# EAGLE design Group Project PCB first draft (EAGLE 9.6.2)
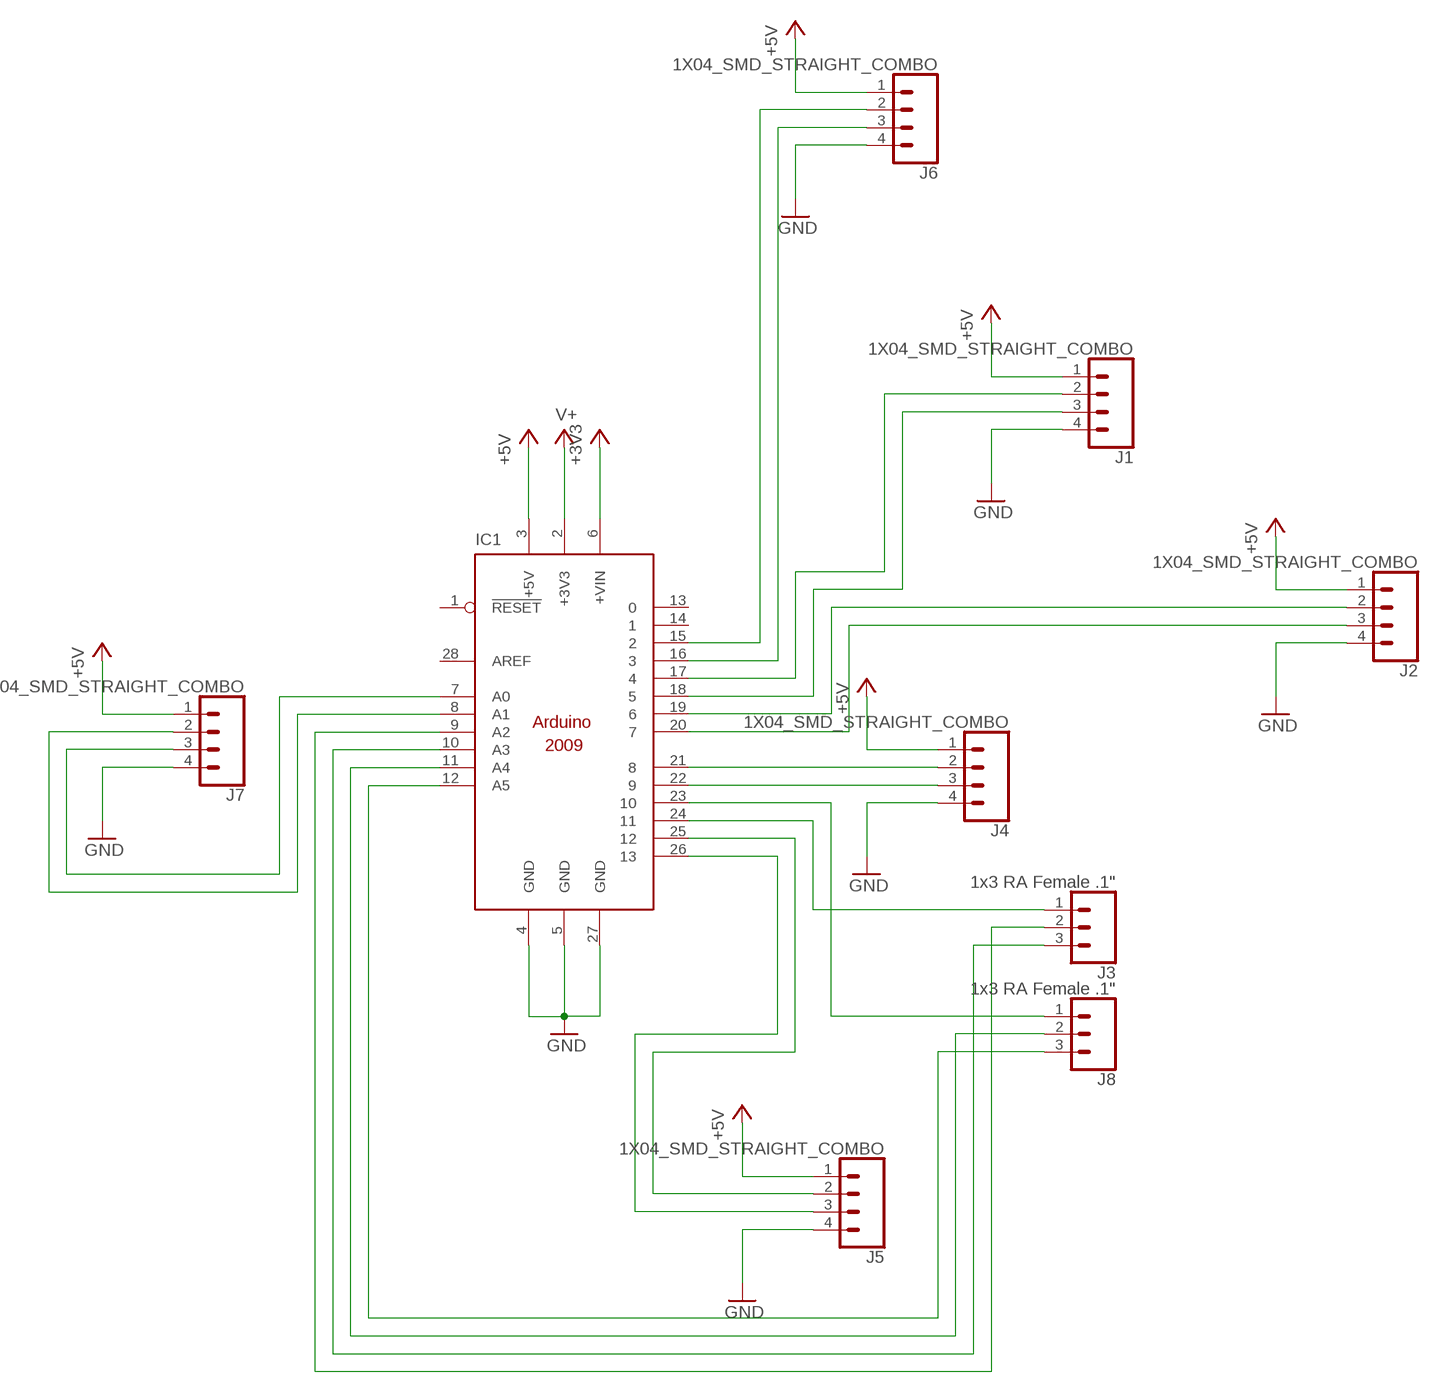
[diagram p0: schematic, sheet 1]

## Parts
IC1  ARDUINO2009_10  [ARDUINO2009]
J1  1X04_SMD_STRAIGHT_COMBO  CONN_04LONGPADS  [1X04_LONGPADS]
J2  1X04_SMD_STRAIGHT_COMBO  CONN_04LONGPADS  [1X04_LONGPADS]
J3  1x3 RA Female .1"  CONN_03LONGPADS  [1X03_LONGPADS]
J4  1X04_SMD_STRAIGHT_COMBO  CONN_04LONGPADS  [1X04_LONGPADS]
J5  1X04_SMD_STRAIGHT_COMBO  CONN_04LONGPADS  [1X04_LONGPADS]
J6  1X04_SMD_STRAIGHT_COMBO  CONN_04LONGPADS  [1X04_LONGPADS]
J7  1X04_SMD_STRAIGHT_COMBO  CONN_04LONGPADS  [1X04_LONGPADS]
J8  1x3 RA Female .1"  CONN_03LONGPADS  [1X03_LONGPADS]

## Nets
+3V3: IC1.6(+VIN)
+5V: IC1.3(+5V) J1.1 J2.1 J4.1 J5.1 J6.1 J7.1
GND: IC1.4(GND) IC1.5(GND) IC1.27(GND) J1.4 J2.4 J4.4 J5.4 J6.4 J7.4
N$1: IC1.17 J1.2
N$2: IC1.18 J1.3
N$3: IC1.21 J4.2
N$4: IC1.22 J4.3
N$5: IC1.19 J2.2
N$6: IC1.20 J2.3
N$7: IC1.8(A1) J7.2
N$8: IC1.7(A0) J7.3
N$9: IC1.25 J5.2
N$10: IC1.26 J5.3
N$11: IC1.15 J6.2
N$12: IC1.16 J6.3
N$13: IC1.23 J8.1
N$14: IC1.24 J3.1
N$15: IC1.9(A2) J3.2
N$16: IC1.11(A4) J8.2
N$17: IC1.10(A3) J3.3
N$18: IC1.12(A5) J8.3
V+: IC1.2(+3V3)
Unconnected: IC1.1(!RESET) IC1.13 IC1.14 IC1.28(AREF)

## Library data of the parts
IC1 = arduino:ARDUINO2009_1: The Arduino Duemilanove ("2009") is a microcontroller board based on the ATmega168 or ATmega328. - 14 digital input/output pins (of which 6 can be used as PWM outputs) - 6 analog inputs, a 16 MHz crystal oscillator - USB connection - power jack - ISP header - reset button It contains everything needed to support the microcontroller; simply connect it to a computer with a USB cable or power it with a AC-to-DC adapter or battery to get started http://arduino.cc/en/Main/ArduinoBoardDuemilanove
J1 J2 J4-J7 = EENG3110 V1 Library:CONN_04: Multi connection point. Often used as Generic Header-pin footprint for 0.1 inch spaced/style header connections On any of the 0.1 inch spaced packages, you can populate with these: Break Away Headers - Straight <https://www.sparkfun.com/products/116> (PRT-00116) Break Away Male Headers - Right Angle <https://www.sparkfun.com/products/553> (PRT-00553) Female Headers <https://www.sparkfun.com/products/115> (PRT-00115) Break Away Headers - Machine Pin <https://www.sparkfun.com/products/117> (PRT-00117) Break Away Female Headers - Swiss Machine Pin <https://www.sparkfun.com/products/743> (PRT-00743) For SCREWTERMINALS and SPRING TERMINALS visit here: Screw Terimnals on SparkFun.com <https://www.sparkfun.com/search/results?term=Screw+Terminals> (5mm/3.5mm/2.54mm spacing) This device is also useful as a general connection point to wire up your design to another part of your project. Our various solder wires solder well into these plated through hole pads. Hook-Up Wire - Assortment (Stranded, 22 AWG) <https://www.sparkfun.com/products/11375> (PRT-11375) Hook-Up Wire - Assortment (Solid Core, 22 AWG) <https://www.sparkfun.com/products/11367> (PRT-11367) View the entire wire category on our website here <https://www.sparkfun.com/categories/141> Special notes: Molex polarized connector foot print use with SKU : PRT-08231 with associated crimp pins and housings. 1MM SMD Version SKU: PRT-10208; PROD_ID: CONN-08511; SF_ID: PRT-12638
J3 J8 = EENG3110 V1 Library:CONN_03: Multi connection point. Often used as Generic Header-pin footprint for 0.1 inch spaced/style header connections On any of the 0.1 inch spaced packages, you can populate with these: Break Away Headers - Straight <https://www.sparkfun.com/products/116> (PRT-00116) Break Away Male Headers - Right Angle <https://www.sparkfun.com/products/553> (PRT-00553) Female Headers <https://www.sparkfun.com/products/115> (PRT-00115) Break Away Headers - Machine Pin <https://www.sparkfun.com/products/117> (PRT-00117) Break Away Female Headers - Swiss Machine Pin <https://www.sparkfun.com/products/743> (PRT-00743) Stackable Header - 3 Pin (Female, 0.1") <https://www.sparkfun.com/products/13875> (PRT-13875) For SCREWTERMINALS and SPRING TERMINALS visit here: Screw Terimnals on SparkFun.com <https://www.sparkfun.com/search/results?term=Screw+Terminals> (5mm/3.5mm/2.54mm spacing) This device is also useful as a general connection point to wire up your design to another part of your project. Our various solder wires solder well into these plated through hole pads. Hook-Up Wire - Assortment (Stranded, 22 AWG) <https://www.sparkfun.com/products/11375> (PRT-11375) Hook-Up Wire - Assortment (Solid Core, 22 AWG) <https://www.sparkfun.com/products/11367> (PRT-11367) View the entire wire category on our website here <https://www.sparkfun.com/categories/141> Special notes: Molex polarized connector foot print use with SKU : PRT-08232 with associated crimp pins and housings.; PROD_ID: CONN-10925; SF_ID: PRT-08235; SF_SKU: PRT-08433

## Board
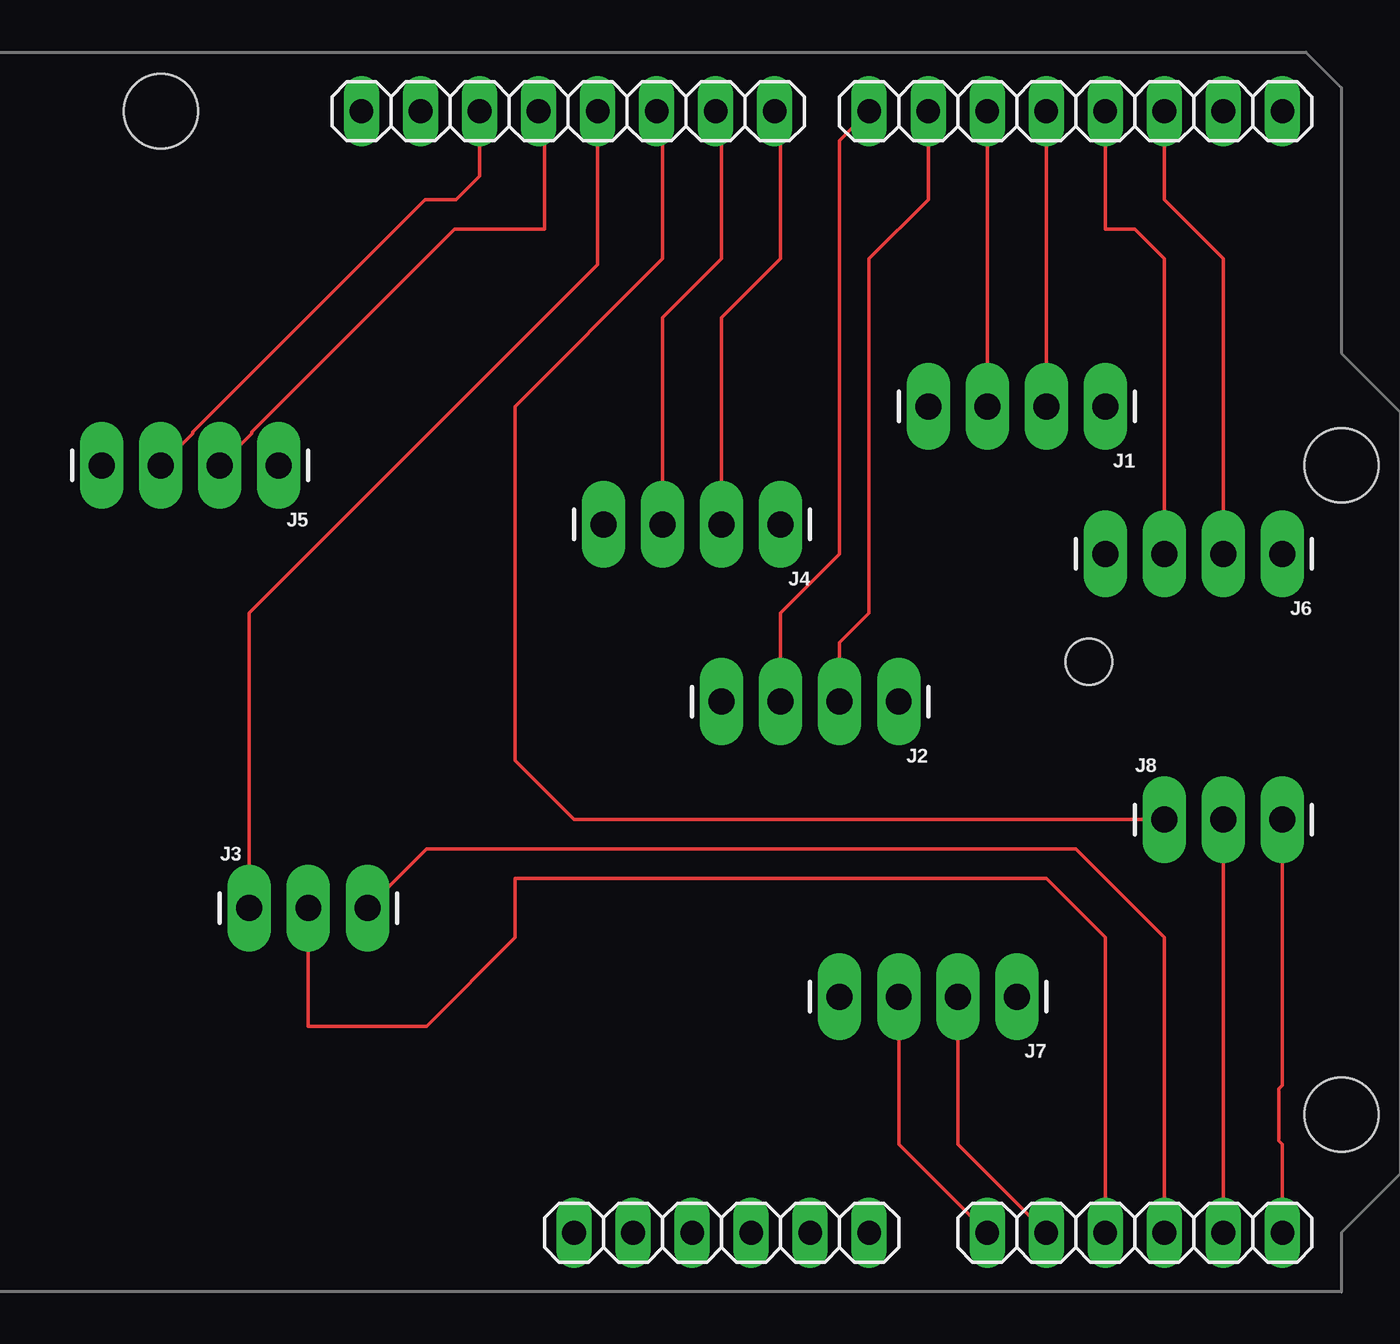
[diagram p1: board, top side]
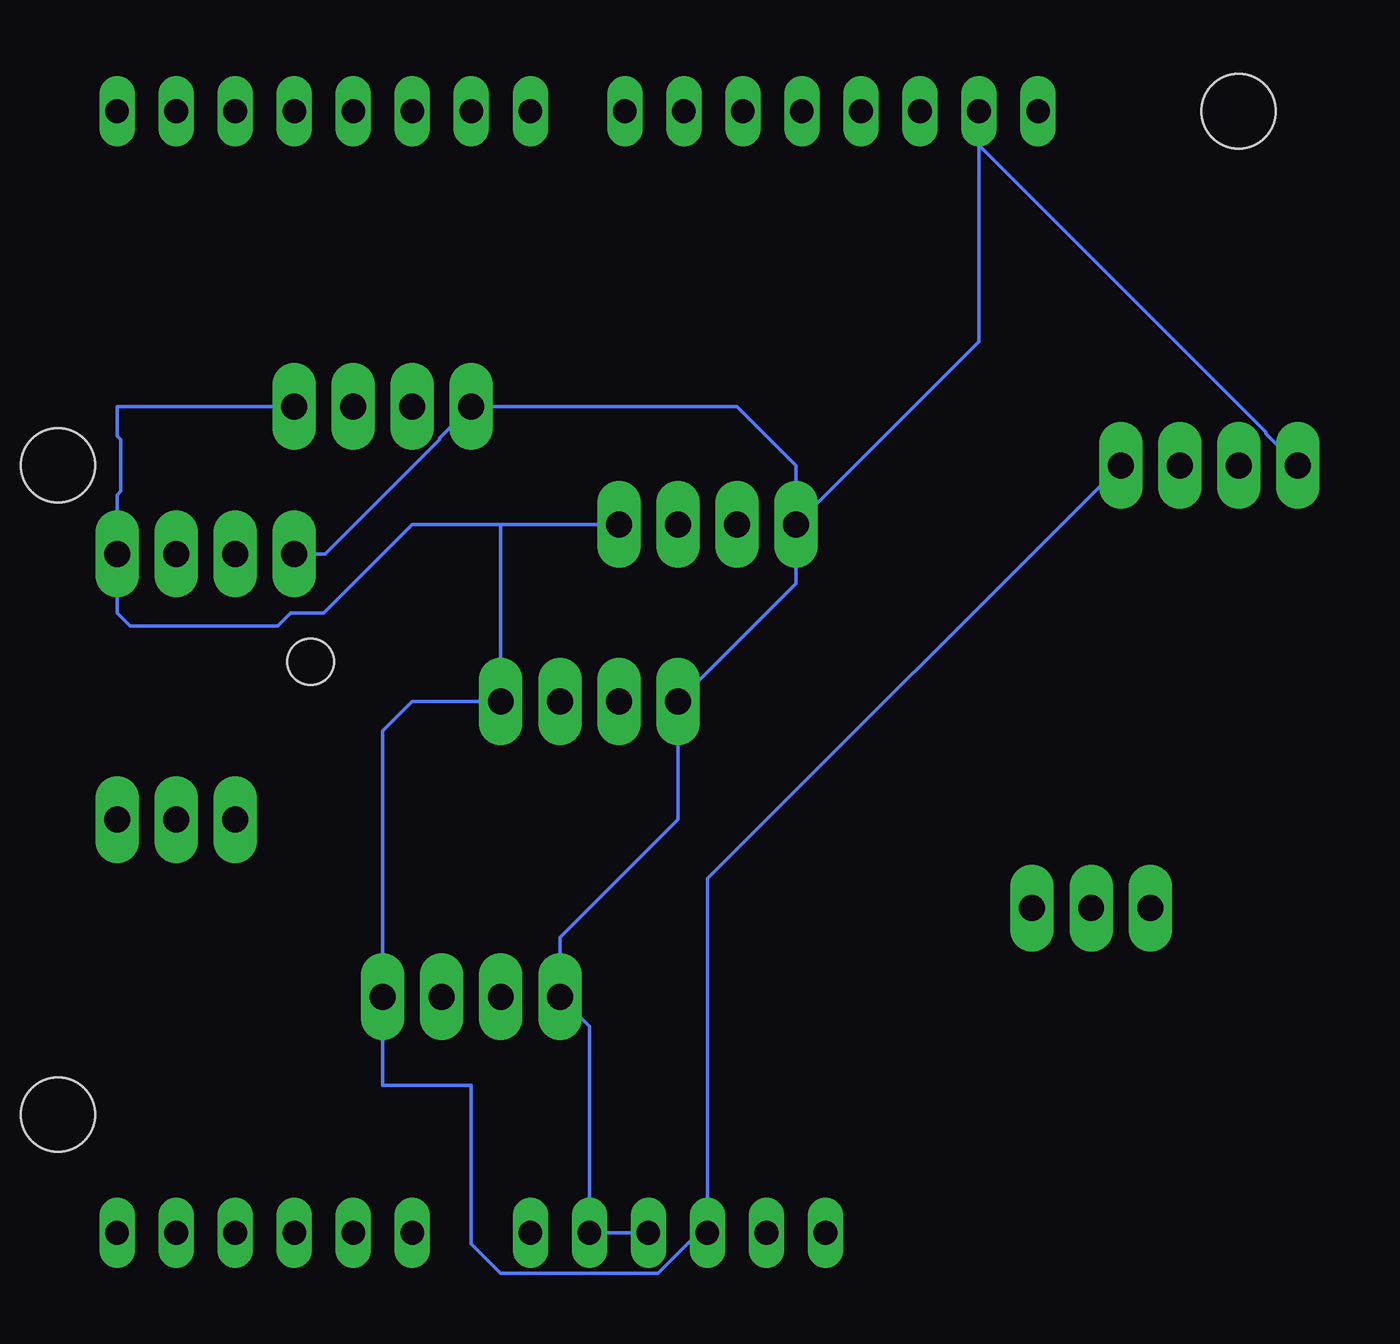
[diagram p2: board, bottom side, seen from below]

No outline drawn. Coordinates in mm, seen from the top.
Copper layers (1*16): Top 0.035mm / dielectric 1.5mm / Bottom 0.035mm
Design rules "default": minimum track width 6mil, minimum drill 0.35mm, track to track 6mil, track to pad 6mil, pad to pad 6mil, via to via 6mil, smd to smd 6mil, copper to edge 40mil, drill to drill 6mil, minimum pad ring 10mil, minimum via ring 8mil, stop-mask expansion 4mil, vias tented up to drill 0mil, thermal gap 10mil

### Footprints (pad centres in the part's own frame; a part is rotated, then mirrored left to right if it is on the bottom)
ARDUINO2009 = drill 1.016 long: 1 33.02,2.54; 2 35.56,2.54; 3 38.1,2.54; 4 40.64,2.54; 5 43.18,2.54; 6 45.72,2.54; 7 50.8,2.54; 8 53.34,2.54; 9 55.88,2.54; 10 58.42,2.54; 11 60.96,2.54; 12 63.5,2.54; 13 63.5,50.8; 14 60.96,50.8; 15 58.42,50.8; 16 55.88,50.8; 17 53.34,50.8; 18 50.8,50.8; 19 48.26,50.8; 20 45.72,50.8; 21 41.656,50.8; 22 39.116,50.8; 23 36.576,50.8; 24 34.036,50.8; 25 31.496,50.8; 26 28.956,50.8; 27 26.416,50.8; 28 23.876,50.8 | hole 3.2: 15.24,50.8; 66.04,35.56; 66.04,7.62 | hole 2: 55.17,27.114
1X04_LONGPADS = drill 1.118 pad 1.88 long: 1 0,0; 2 2.54,0; 3 5.08,0; 4 7.62,0
1X03_LONGPADS = drill 1.118 pad 1.88 long: 1 0,0; 2 2.54,0; 3 5.08,0

### Placement (x,y rotation side)
IC1  -11.43,-67.31 0 top
J1  44.45,-29.21 180 top
J2  35.56,-41.91 180 top
J3  7.62,-50.8 0 top
J4  30.48,-34.29 180 top
J5  8.89,-31.75 180 top
J6  52.07,-35.56 180 top
J7  40.64,-54.61 180 top
J8  46.99,-46.99 0 top

### Tracks (layer width: path | path; a pad name or v marks a point on that pad's centre or on a via)
+5V
  Bottom 0.152: J5.1 26.67,-49.53 IC1.3 27.05,-64.77 28.8,-66.52 35.56,-66.52 36.83,-65.25 36.83,-58.42 40.64,-58.42 J7.1 40.64,-43.18 39.37,-41.91 J2.1 35.56,-34.29 J4.1 39.37,-34.29 43.18,-38.1 44.61,-38.1 45.16,-38.66 51.51,-38.66 52.07,-38.1 J6.1 52.07,-33.02 51.92,-32.87 51.92,-30.64 52.07,-30.48 52.07,-29.21 J1.1
GND
  Bottom 0.152: IC1.4 IC1.5 31.75,-55.88 J7.4 33.02,-52.07 27.94,-46.99 J2.4 22.86,-36.83 J4.4 | J4.4 14.99,-26.42 IC1.27 14.99,-17.98 2.64,-30.33 2.64,-30.38 J5.4 | J4.4 22.86,-31.75 25.4,-29.21 J1.4 38.2,-30.58 38.2,-30.63 43.13,-35.56 J6.4
N$1
  Top 0.152: J1.2 IC1.17
N$2
  Top 0.152: J1.3 IC1.18
N$3
  Top 0.152: J4.2 27.94,-25.4 30.48,-22.86 30.48,-16.76 IC1.21
N$4
  Top 0.152: J4.3 25.4,-25.4 27.94,-22.86 27.94,-16.76 IC1.22
N$5
  Top 0.152: J2.2 33.02,-39.37 34.29,-38.1 34.29,-22.86 36.83,-20.32 IC1.19
N$6
  Top 0.152: J2.3 30.48,-38.1 33.02,-35.56 33.02,-17.78 IC1.20
N$7
  Top 0.152: IC1.8 38.1,-60.96 J7.2
N$8
  Top 0.152: IC1.7 35.56,-60.96 J7.3
N$9
  Top 0.152: J5.2 7.72,-30.38 7.72,-30.33 16.46,-21.59 20.32,-21.59 20.32,-16.76 IC1.25
N$10
  Top 0.152: J5.3 5.18,-30.38 5.18,-30.33 15.19,-20.32 16.51,-20.32 17.53,-19.3 IC1.26
N$11
  Top 0.152: IC1.15 46.99,-20.32 49.53,-22.86 J6.2
N$12
  Top 0.152: J6.3 46.99,-22.86 45.72,-21.59 44.45,-21.59 IC1.16
N$13
  Top 0.152: J8.1 21.59,-46.99 19.05,-44.45 19.05,-29.21 25.4,-22.86 25.4,-16.76 IC1.23
N$14
  Top 0.152: J3.1 7.62,-38.1 22.61,-23.11 IC1.24
N$15
  Top 0.152: J3.2 10.16,-55.88 15.24,-55.88 19.05,-52.07 19.05,-49.53 41.91,-49.53 44.45,-52.07 IC1.9
N$16
  Top 0.152: J8.2 IC1.11
N$17
  Top 0.152: J3.3 15.24,-48.26 43.18,-48.26 46.99,-52.07 IC1.10
N$18
  Top 0.152: J8.3 52.07,-58.42 51.92,-58.58 51.92,-60.8 52.07,-60.96 IC1.12